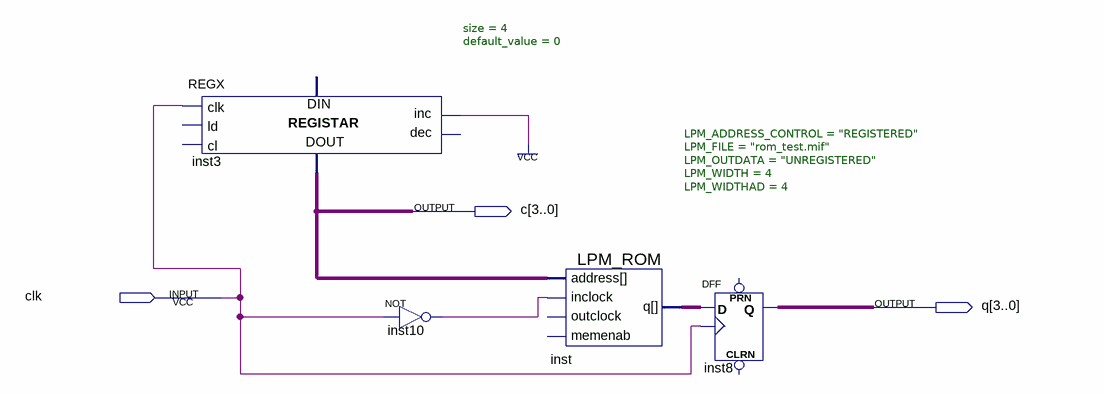
[diagram p0: schematic sheet]
// Quartus schematic rom_test.bdf as structural Verilog: 4 symbols, 3 pins
module rom_test (
  input  clk,
  output [3:0] c,
  output [3:0] q
);

  wire inst10_out;
  wire [3:0] inst_q;

  REGX #(.size(4), .default_value(0)) inst3 (.clk(clk), .inc(1'b1), .data_out(c));  // open: ld, cl, dec, data_in
  not inst10 (inst10_out, clk);
  LPM_ROM #(.LPM_ADDRESS_CONTROL("REGISTERED"), .LPM_FILE("rom_test.mif"), .LPM_OUTDATA("UNREGISTERED"), .LPM_WIDTH(4), .LPM_WIDTHAD(4)) inst (
    .address(c), .inclock(inst10_out), .q(inst_q));  // open: outclock, memenab
  DFF inst8[3:0] (.CLK(clk), .D(inst_q), .Q(q));  // open: CLRN, PRN
endmodule
